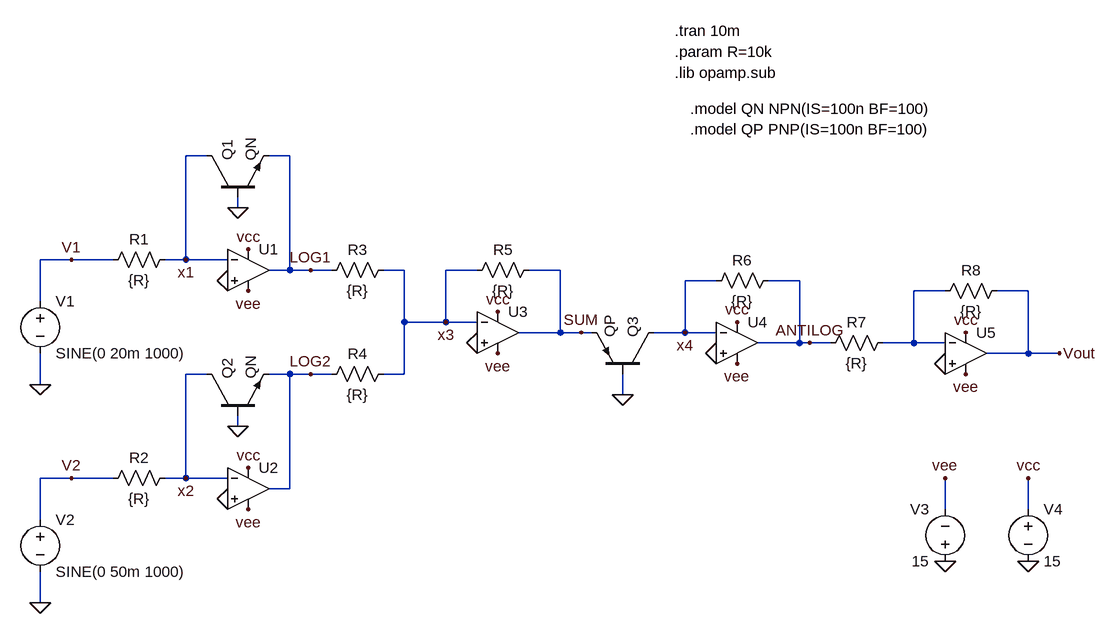
[diagram p0: schematic multiplier2.asc]
multiplier2.asc, the LTspice schematic file:
Version 4.1
SHEET 1 1364 680
WIRE -192 -304 -224 -304
WIRE -64 -304 -96 -304
WIRE -144 -224 -144 -240
WIRE -400 -144 -448 -144
WIRE -336 -144 -400 -144
WIRE -224 -144 -224 -304
WIRE -224 -144 -256 -144
WIRE -160 -144 -224 -144
WIRE -64 -128 -64 -304
WIRE -64 -128 -96 -128
WIRE -32 -128 -64 -128
WIRE 0 -128 -32 -128
WIRE 112 -128 80 -128
WIRE 224 -128 176 -128
WIRE 352 -128 304 -128
WIRE 592 -112 544 -112
WIRE 720 -112 672 -112
WIRE 944 -96 896 -96
WIRE 1072 -96 1024 -96
WIRE -448 -80 -448 -144
WIRE 112 -48 112 -128
WIRE 176 -48 176 -128
WIRE 176 -48 112 -48
WIRE 224 -48 176 -48
WIRE 352 -32 352 -128
WIRE 352 -32 288 -32
WIRE 384 -32 352 -32
WIRE 400 -32 384 -32
WIRE 544 -32 544 -112
WIRE 544 -32 496 -32
WIRE 592 -32 544 -32
WIRE 720 -16 720 -112
WIRE 720 -16 656 -16
WIRE 736 -16 720 -16
WIRE 768 -16 736 -16
WIRE 896 -16 896 -96
WIRE 896 -16 848 -16
WIRE 944 -16 896 -16
WIRE 1072 0 1072 -96
WIRE 1072 0 1008 0
WIRE 1120 0 1072 0
WIRE -192 32 -224 32
WIRE -64 32 -96 32
WIRE -32 32 -64 32
WIRE 0 32 -32 32
WIRE 112 32 112 -48
WIRE 112 32 80 32
WIRE -448 48 -448 0
WIRE 448 64 448 32
WIRE -144 112 -144 96
WIRE -400 192 -448 192
WIRE -336 192 -400 192
WIRE -224 192 -224 32
WIRE -224 192 -256 192
WIRE -160 192 -224 192
WIRE -64 208 -64 32
WIRE -64 208 -96 208
WIRE 944 240 944 192
WIRE 1072 240 1072 192
WIRE -448 256 -448 192
WIRE -448 384 -448 336
FLAG -448 48 0
FLAG -144 -224 0
FLAG -224 -144 x1
FLAG -448 384 0
FLAG -144 112 0
FLAG -224 192 x2
FLAG 176 -48 x3
FLAG 544 -32 x4
FLAG 1120 0 Vout
FLAG -128 -96 vee
FLAG -128 240 vee
FLAG 256 0 vee
FLAG 624 16 vee
FLAG 976 32 vee
FLAG -128 -160 vcc
FLAG 256 -64 vcc
FLAG -128 176 vcc
FLAG 624 -48 vcc
FLAG 976 -32 vcc
FLAG -160 -112 0
FLAG 224 -16 0
FLAG 592 0 0
FLAG 944 16 0
FLAG -160 224 0
FLAG 944 320 0
FLAG 1072 320 0
FLAG -400 192 V2
FLAG -400 -144 V1
FLAG 944 192 vee
FLAG 1072 192 vcc
FLAG 448 64 0
FLAG -32 -128 LOG1
FLAG -32 32 LOG2
FLAG 384 -32 SUM
FLAG 736 -16 ANTILOG
SYMBOL npn -192 -240 R270
SYMATTR InstName Q1
SYMATTR Value QN
SYMBOL voltage -448 -96 R0
WINDOW 123 0 0 Left 0
WINDOW 39 0 0 Left 0
SYMATTR InstName V1
SYMATTR Value SINE(0 20m 1000)
SYMBOL res -240 -160 R90
WINDOW 0 0 56 VBottom 2
WINDOW 3 32 56 VTop 2
SYMATTR InstName R1
SYMATTR Value {R}
SYMBOL npn -192 96 R270
SYMATTR InstName Q2
SYMATTR Value QN
SYMBOL voltage -448 240 R0
WINDOW 123 0 0 Left 0
WINDOW 39 0 0 Left 0
SYMATTR InstName V2
SYMATTR Value SINE(0 50m 1000)
SYMBOL res -240 176 R90
WINDOW 0 0 56 VBottom 2
WINDOW 3 32 56 VTop 2
SYMATTR InstName R2
SYMATTR Value {R}
SYMBOL res 96 -144 R90
WINDOW 0 0 56 VBottom 2
WINDOW 3 32 56 VTop 2
SYMATTR InstName R3
SYMATTR Value {R}
SYMBOL res 96 16 R90
WINDOW 0 0 56 VBottom 2
WINDOW 3 32 56 VTop 2
SYMATTR InstName R4
SYMATTR Value {R}
SYMBOL res 320 -144 R90
WINDOW 0 0 56 VBottom 2
WINDOW 3 32 56 VTop 2
SYMATTR InstName R5
SYMATTR Value {R}
SYMBOL res 688 -128 R90
WINDOW 0 0 56 VBottom 2
WINDOW 3 32 56 VTop 2
SYMATTR InstName R6
SYMATTR Value {R}
SYMBOL res 864 -32 R90
WINDOW 0 0 56 VBottom 2
WINDOW 3 32 56 VTop 2
SYMATTR InstName R7
SYMATTR Value {R}
SYMBOL res 1040 -112 R90
WINDOW 0 0 56 VBottom 2
WINDOW 3 32 56 VTop 2
SYMATTR InstName R8
SYMATTR Value {R}
SYMBOL voltage 944 336 R180
WINDOW 0 24 96 Left 2
WINDOW 3 24 16 Left 2
WINDOW 123 0 0 Left 0
WINDOW 39 0 0 Left 0
SYMATTR InstName V3
SYMATTR Value 15
SYMBOL voltage 1072 224 R0
WINDOW 123 0 0 Left 0
WINDOW 39 0 0 Left 0
SYMATTR InstName V4
SYMATTR Value 15
SYMBOL OpAmps\\UniversalOpAmp2 -128 -128 R0
SYMATTR InstName U1
SYMBOL OpAmps\\UniversalOpAmp2 -128 208 R0
SYMATTR InstName U2
SYMBOL OpAmps\\UniversalOpAmp2 256 -32 R0
SYMATTR InstName U3
SYMBOL OpAmps\\UniversalOpAmp2 624 -16 R0
SYMATTR InstName U4
SYMBOL OpAmps\\UniversalOpAmp2 976 0 R0
SYMATTR InstName U5
SYMBOL pnp 496 32 M270
SYMATTR InstName Q3
SYMATTR Value QP
TEXT 528 -496 Left 2 !.tran 10m
TEXT 528 -464 Left 2 !.param R=10k
TEXT 528 -432 Left 2 !.lib opamp.sub
TEXT 552 -376 Left 2 !.model QN NPN(IS=100n BF=100)\n.model QP PNP(IS=100n BF=100)

The netlist it stands for:
* multiplier2.asc
Q1 x1 0 LOG1 0 QN
V1 V1 0 SINE(0 20m 1000)
R1 x1 V1 {R}
Q2 x2 0 LOG2 0 QN
V2 V2 0 SINE(0 50m 1000)
R2 x2 V2 {R}
R3 x3 LOG1 {R}
R4 x3 LOG2 {R}
R5 SUM x3 {R}
R6 ANTILOG x4 {R}
R7 N001 ANTILOG {R}
R8 Vout N001 {R}
V3 0 vee 15
V4 vcc 0 15
X§U1 0 x1 vcc vee LOG1 level2 Avol=1Meg GBW=10Meg Slew=10Meg Ilimit=25m Rail=0 Vos=0 En=0 Enk=0 In=0 Ink=0 Rin=500Meg  ; pins In+ In- V+ V- OUT
X§U2 0 x2 vcc vee LOG2 level2 Avol=1Meg GBW=10Meg Slew=10Meg Ilimit=25m Rail=0 Vos=0 En=0 Enk=0 In=0 Ink=0 Rin=500Meg  ; pins In+ In- V+ V- OUT
X§U3 0 x3 vcc vee SUM level2 Avol=1Meg GBW=10Meg Slew=10Meg Ilimit=25m Rail=0 Vos=0 En=0 Enk=0 In=0 Ink=0 Rin=500Meg  ; pins In+ In- V+ V- OUT
X§U4 0 x4 vcc vee ANTILOG level2 Avol=1Meg GBW=10Meg Slew=10Meg Ilimit=25m Rail=0 Vos=0 En=0 Enk=0 In=0 Ink=0 Rin=500Meg  ; pins In+ In- V+ V- OUT
X§U5 0 N001 vcc vee Vout level2 Avol=1Meg GBW=10Meg Slew=10Meg Ilimit=25m Rail=0 Vos=0 En=0 Enk=0 In=0 Ink=0 Rin=500Meg  ; pins In+ In- V+ V- OUT
Q3 x4 0 SUM 0 QP
.model NPN NPN
.model PNP PNP
.lib standard.bjt
.tran 10m
.param R=10k
.lib opamp.sub
.model QN NPN(IS=100n BF=100)
.model QP PNP(IS=100n BF=100)
.lib UniversalOpAmp2.lib
.backanno
.end

* Results of the author's LTspice run, read from the files saved beside the schematic
* Operating Point, zero values left out:
*   V(vcc) = 15 V
*   V(vee) = -15 V
*   I(V3) = -7.492 mA
*   I(V4) = -7.492 mA
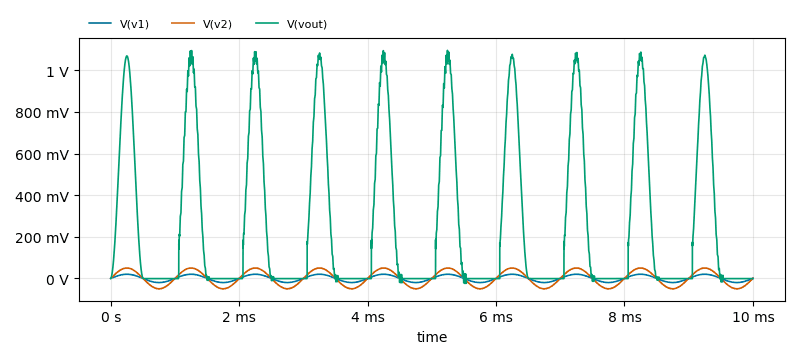
[diagram p1: Transient Analysis of multiplier2.asc, plotted from the saved traces]
* Transient Analysis, 1 run:
*   V(v1): min -20 mV, max 20 mV, average -12.45 nV, rms 14.14 mV, last 0 V
*   V(v2): min -50 mV, max 50 mV, average -31.11 nV, rms 35.35 mV, last 0 V
*   V(vout): min -24.65 mV, max 1.096 V, average 268.9 mV, rms 467.2 mV, last -1 mV